# Altium project Sitara.PrjPCB (part 2 of 2)

## Sheet RF.SchDoc: sitara
size A4; CompanyName: SPAN; Engineer: Goverdhan; Organization: University of Utah; Address1: 50 S Central Campus Dr; Address2: MEB Rm 3129; Address3: Salt Lake City, Utah 84115; Address4: USA; Revision: 1; SheetNumber: 4; SheetTotal: 4
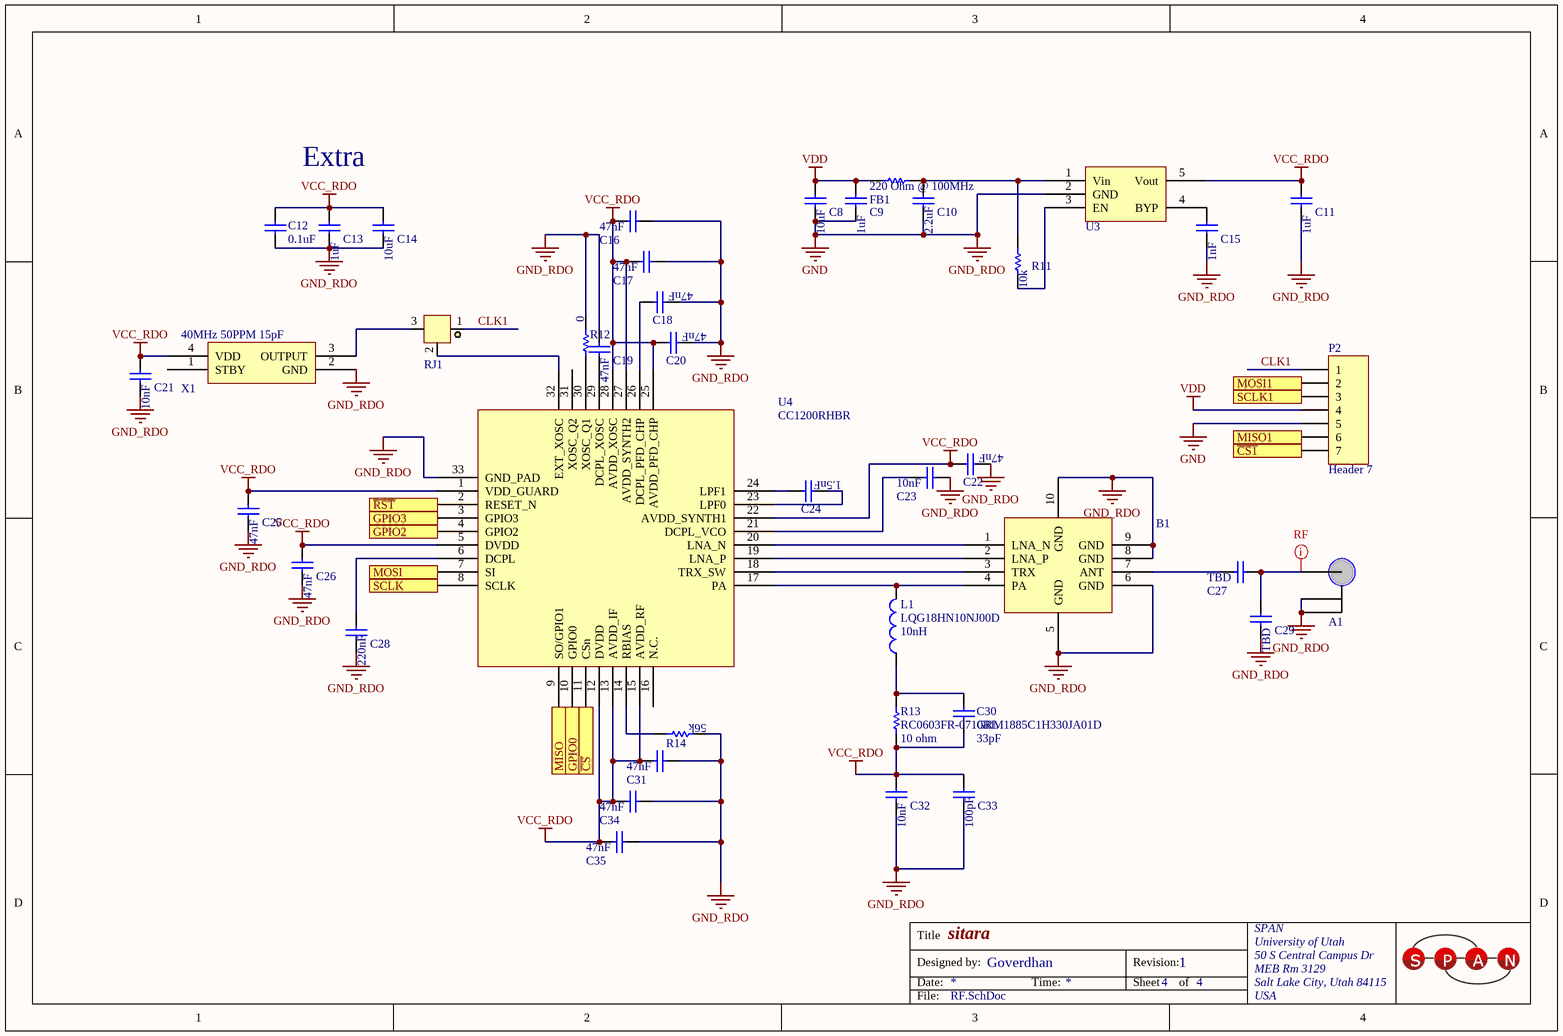
[diagram p3: RF.SchDoc]

### Parts
A1  U.FL-R-SMT(01)  [U.FL-R-SMT-1]  (value not drawn)
B1  0900PC15J0013  [0900PC15J0013]  (value not drawn)
C8  GRM188R60J106ME47D  [CAPC1608X08N (0603)]  (value not drawn)
C9  GRM188R61A105KA61D  [CAPC1608X08N (0603)]  (value not drawn)
C10  GRM188F51A225ZE01D  [CAPC1608X08N (0603)]  (value not drawn)
C11  GRM188R61A105KA61D  [CAPC1608X08N (0603)]  (value not drawn)
C12  0.1uF  [0603_Cap]
C13  GRM188R61A105KA61D  [CAPC1608X08N (0603)]  (value not drawn)
C14  GRM188R60J106ME47D  [CAPC1608X08N (0603)]  (value not drawn)
C15  GRM1885C1H102JA01D  [CAPC1608X08N (0603)]  (value not drawn)
C16  GCM188R71H473KA55D  [CAPC1608X08N (0603)]  (value not drawn)
C17  GCM188R71H473KA55D  [CAPC1608X08N (0603)]  (value not drawn)
C18  GCM188R71H473KA55D  [CAPC1608X08N (0603)]  (value not drawn)
C19  GCM188R71H473KA55D  [CAPC1608X08N (0603)]  (value not drawn)
C20  GCM188R71H473KA55D  [CAPC1608X08N (0603)]  (value not drawn)
C21  GRM188R71H103MA01D  [CAPC1608X08N (0603)]  (value not drawn)
C22  GCM188R71H473KA55D  [CAPC1608X08N (0603)]  (value not drawn)
C23  GRM188R71H103MA01D  [CAPC1608X08N (0603)]  (value not drawn)
C24  GRM1885C1H152JA01D  [CAPC1608X08N (0603)]  (value not drawn)
C25  GCM188R71H473KA55D  [CAPC1608X08N (0603)]  (value not drawn)
C26  GCM188R71H473KA55D  [CAPC1608X08N (0603)]  (value not drawn)
C27  C_TBD  [CAPC1608X08N (0603)]  (value not drawn)
C28  GRM188R71E224KA88D  [CAPC1608X08N (0603)]  (value not drawn)
C29  C_TBD  [CAPC1608X08N (0603)]  (value not drawn)
C30  GRM1885C1H330JA01D  value 33pF  [CAPC1608X08N (0603)]
C31  GCM188R71H473KA55D  [CAPC1608X08N (0603)]  (value not drawn)
C32  GRM188R71H103MA01D  [CAPC1608X08N (0603)]  (value not drawn)
C33  GQM1885C1H101JB01D  [CAPC1608X08N (0603)]  (value not drawn)
C34  GCM188R71H473KA55D  [CAPC1608X08N (0603)]  (value not drawn)
C35  GCM188R71H473KA55D  [CAPC1608X08N (0603)]  (value not drawn)
FB1  BLM18BD221SN1D  [RESC1608X06N (0603)]  (value not drawn)
L1  LQG18HN10NJ00D  value 10nH  [INDC1608X08N]
P2  Header 7  [HDR1X7]
R11  RC0603FR-0710KL  [RESC1608X06N (0603)]  (value not drawn)
R12  MCR03ERTJ000  [RESC1608X06N (0603)]  (value not drawn)
R13  RC0603FR-0710RL  value 10 ohm  [RESC1608X06N (0603)]
R14  MCR03ERTJ563  [RESC1608X06N (0603)]  (value not drawn)
RJ1  R_J  [RJ]  (value not drawn)
U3  FAN2500S30X  [SOT95P280X145-5N]  (value not drawn)
U4  CC1200RHBR  [S-PVQFN-N32]
X1  ASE-40.000MHZ-L-C-T  [3.2x2.5x1.2mmXTAL]  (value not drawn)

### Ports
GPIO0, GPIO2, GPIO3, MISO, MISO1, MOSI, MOSI1, SCLK, SCLK1, ~{CS1}, ~{CS}, ~{RST}

### Nets
GND: A1.2 A1.3 B1.5(GND) B1.6(GND) B1.8(GND) B1.9(GND) B1.10(GND) C8.1 C9.1 C10.1 C11.1 C12.1 C13.1 C14.1 C15.1 C16.2 C17.2 C18.1 C19.2 C20.1 C21.1 C22.1 C23.2 C25.1 C26.1 C28.1 C29.1 C31.2 C32.1 C33.1 C34.2 C35.2 P2.5 R12.1 R14.1 U3.2(GND) U4.33(GND_PAD) X1.2(GND)  [also labelled GND_RDO]
VCC_RDO: C11.2 C12.2 C13.2 C14.2 C16.1 C17.1 C20.2 C21.2 C22.2 C25.2 C26.2 C30.1 C31.1 C32.2 C33.2 C34.1 C35.1 R13.1 U3.5(Vout) U4.1(VDD_GUARD) U4.5(DVDD) U4.12(DVDD) U4.13(AVDD_IF) U4.15(AVDD_RF) U4.22(AVDD_SYNTH1) U4.25(AVDD_PFD_CHP) U4.27(AVDD_SYNTH2) U4.28(AVDD_XOSC) X1.4(VDD)
VDD: C8.2 C9.2 FB1.1 P2.4
CHFILT_1: U4.4(GPIO2) ; port GPIO2
CLK1: P2.1 RJ1.1
GPIO0_1: U4.10(GPIO0) ; port GPIO0
MAGN_1: U4.3(GPIO3) ; port GPIO3
RST_N: U4.2(RESET_N) ; port ~{RST}
SPI0_CS: P2.7 ; port ~{CS1}
SPI0_MISO: P2.6 ; port MISO1
SPI0_MOSI: P2.2 ; port MOSI1
SPI0_SCLK: P2.3 ; port SCLK1
SPI1_CS: U4.11(CSn) ; port ~{CS}
SPI1_MISO: U4.9(SO/GPIO1) ; port MISO
SPI1_MOSI: U4.7(SI) ; port MOSI
SPI1_SCLK: U4.8(SCLK) ; port SCLK
NetA1_1: A1.1 C27.2 C29.2
NetB1_1: B1.1(LNA_N) U4.20(LNA_N)
NetB1_2: B1.2(LNA_P) U4.19(LNA_P)
NetB1_3: B1.3(TRX) U4.18(TRX_SW)
NetB1_4: B1.4(PA) L1.2 U4.17(PA)
NetB1_7: B1.7(ANT) C27.1
NetC10_2: C10.2 FB1.2 R11.2 U3.1(Vin)
NetC15_2: C15.2 U3.4(BYP)
NetC18_2: C18.2 U4.26(DCPL_PFD_CHP)
NetC19_1: C19.1 U4.29(DCPL_XOSC)
NetC23_1: C23.1 U4.21(DCPL_VCO)
NetC24_1: C24.1 U4.23(LPF0)
NetC24_2: C24.2 U4.24(LPF1)
NetC28_2: C28.2 U4.6(DCPL)
NetC30_2: C30.2 L1.1 R13.2
NetR11_1: R11.1 U3.3(EN)
NetR12_2: R12.2 U4.30(XOSC_Q1)
NetR14_2: R14.2 U4.14(RBIAS)
NetRJ1_2: RJ1.2 U4.32(EXT_XOSC)
NetRJ1_3: RJ1.3 X1.3(OUTPUT)

Not connected (* = marked no-connect by the designer): U4 16(N.C.) 31(XOSC_Q2); X1 1(STBY)

### Layout directives
net class RF: NetA1_1

### Notes on the sheet
- Extra
- Title
- Designed by:
- Date:
- Time:
- Revision:
- Sheet
- of
- File:
- (in symbol ASE-40.000MHZ-L-C-T) 40MHz 50PPM 15pF
- (in symbol C_TBD) TBD
- (in symbol GCM188R71H473KA55D) 47nF
- (in symbol GRM188F51A225ZE01D) 2.2uF
- (in symbol GRM188R60J106ME47D) 10uF
- (in symbol GRM188R61A105KA61D) 1uF
- (in symbol GRM188R71E224KA88D) 220nF
- (in symbol GRM188R71H103MA01D) 10nF
- (in symbol GRM1885C1H102JA01D) 1nF
- (in symbol GRM1885C1H152JA01D) 1.5nF
- (in symbol MCR03ERTJ000) 0

### Library data of the parts
A1 = U.FL-R-SMT(01): CONN UMC JACK STR 50 OHM SMD; Manufacturer: Hirose Electric Co Ltd; Connector Style: Ultra Miniature Coaxial; Connector Type: Jack, Male Pin; Contact Termination: Solder; Impedance: 50 Ohm; Frequency - Max: 6GHz; Body Material: Phosphor Bronze; Body Finish: Silver; Center Contact Plating: Gold; Dielectric Material: Liquid Crystal Polymer (LCP); Supplier 1: Digi-Key; Manufacturer Part Number: U.FL-R-SMT(01); RoHS: RoHS Compliant; Category: Connectors, Interconnects; Stock 1: 22286; Pricing 1: 1=1.28, 10=1.122, 25=1.056, 50=1.012, 100=0.968, 250=0.88, 500=0.792, 1000=0.704, 2500=0.638 (USD); Packaging: Bulk; Shield Termination: Solder; Mounting Type: Surface Mount; Cable Group: -; Fastening Type: Snap-On; Features: -; Housing Color: Silver; Ingress Protection: -; Center Contact Material: Phosphor Bronze; Voltage Rating: -; Operating Temperature: -40°C ~ 90°C; ComponentLink1URL: http://www.hirose.co.jp/cataloge_hp/e32119372.pdf; ComponentLink1Description: http://www.hirose.co.jp/cataloge_hp/e32119372.pdf
B1 = 0900PC15J0013: TI CC1120 1121 BALUN FILTER IPC; Manufacturer: Johanson Technology Inc.; Frequency Range: 868MHz ~ 928MHz; Impedance - Unbalanced/Balanced: 50 / 50 Ohm; Phase Difference: 180° ±15; Insertion Loss (Max): 2.0dB; Return Loss (Min): 9.5dB; Supplier 1: Digi-Key; Manufacturer Part Number: 0900PC15J0013; RoHS: RoHS Compliant; Category: RF/IF and RFID; Stock 1: 6483; Pricing 1: 1=1.6, 10=1.563, 25=1.0464, 50=0.9314, 100=0.8533, 250=0.7656, 500=0.74966, 1000=0.5423 (USD); Packaging: Cut Tape (CT); Part Status: Active; Package / Case: 0805 (2012 Metric), 10 PC Pad; Mounting Type: Surface Mount; ComponentLink1URL: http://www.johansontechnology.com/datasheets/highly-integrated-passive-components/0900PC15J0013.pdf; ComponentLink1Description: http://www.johansontechnology.com/datasheets/highly-integrated-passive-components/0900PC15J0013.pdf; Supplier Part Number 1: 712-1586-1-ND
C8 C14 = GRM188R60J106ME47D: CAP CER 10UF 6.3V 20% X5R 0603; Manufacturer: Murata Electronics North America; Capacitance: 10µF; Supplier 1: Digi-Key; Manufacturer Part Number: GRM188R60J106ME47D; RoHS: RoHS Compliant; Category: Capacitors; Stock 1: 2128324; Pricing 1: 1=0.24, 10=0.2, 50=0.1126, 100=0.1, 250=0.075, 500=0.06626, 1000=0.05875 (USD); Packaging: Digi-Reel®; Voltage - Rated: 6.3V; Tolerance: ±20%; Temperature Coefficient: X5R; Mounting Type: Surface Mount, MLCC; Operating Temperature: -55°C ~ 85°C; Applications: General Purpose; Ratings: -; Package / Case: 0603 (1608 Metric); Size / Dimension: 0.063" L x 0.031" W (1.60mm x 0.80mm); Height - Seated (Max): -; Thickness (Max): 0.035" (0.90mm); Lead Spacing: -; Features: -; Lead Style: -; ComponentLink1URL: http://search.murata.co.jp/Ceramy/image/img/A01X/G101/ENG/GRM188R60J106ME47-01.pdf; ComponentLink1Description: http://search.murata.co.jp/Ceramy/image/img/A01X/G101/ENG/GRM188R60J106ME47-01.pdf; Supplier 2: Digi-Key
C9 C11 C13 = GRM188R61A105KA61D: CAP CER 1UF 10V 10% X5R 0603; Manufacturer: Murata Electronics North America; Capacitance: 1.0µF; Supplier 1: Digi-Key; Manufacturer Part Number: GRM188R61A105KA61D; RoHS: RoHS Compliant; Category: Capacitors; Stock 1: 244919; Pricing 1: 1=0.1, 10=0.041, 50=0.0224, 100=0.019, 250=0.01552, 500=0.01328, 1000=0.01035 (USD); Packaging: Cut Tape (CT); Voltage - Rated: 10V; Tolerance: ±10%; Temperature Coefficient: X5R; Mounting Type: Surface Mount, MLCC; Operating Temperature: -55°C ~ 85°C; Applications: General Purpose; Ratings: -; Package / Case: 0603 (1608 Metric); Size / Dimension: 0.063" L x 0.031" W (1.60mm x 0.80mm); Height - Seated (Max): -; Thickness (Max): 0.035" (0.90mm); Lead Spacing: -; Features: -; Lead Style: -; ComponentLink1URL: http://search.murata.co.jp/Ceramy/image/img/A01X/G101/ENG/GRM188R61A105KA61-01.pdf; ComponentLink1Description: http://search.murata.co.jp/Ceramy/image/img/A01X/G101/ENG/GRM188R61A105KA61-01.pdf
C10 = GRM188F51A225ZE01D: CAP CER 2.2UF 10V Y5V 0603; Manufacturer: Murata Electronics North America; Capacitance: 2.2µF; Tolerance: -20%, +80%; Temperature Coefficient: Y5V (F); Supplier 1: Digi-Key; Manufacturer Part Number: GRM188F51A225ZE01D; RoHS: RoHS Compliant; Category: Capacitors; Stock 1: 8000; Pricing 1: 4000=0.02043, 8000=0.019, 12000=0.01805, 28000=0.0171 (USD); Packaging: Tape & Reel (TR); Voltage - Rated: 10V; Mounting Type: Surface Mount, MLCC; Operating Temperature: -30°C ~ 85°C; Applications: General Purpose; Ratings: -; Package / Case: 0603 (1608 Metric); Size / Dimension: 0.063" L x 0.031" W (1.60mm x 0.80mm); Height - Seated (Max): -; Thickness (Max): 0.035" (0.90mm); Lead Spacing: -; Features: -; Lead Style: -; ComponentLink1URL: http://search.murata.co.jp/Ceramy/image/img/A01X/G101/ENG/GRM188F51A225ZE01-01.pdf; ComponentLink1Description: http://search.murata.co.jp/Ceramy/image/img/A01X/G101/ENG/GRM188F51A225ZE01-01.pdf
C12 = 0603YC104KAT4A: CAP CER 0.1UF 16V X7R 0603; Manufacturer: AVX Corporation; Capacitance: 0.1µF; Tolerance: ±10%; Supplier 1: Digi-Key; Manufacturer Part Number: 0603YC104KAT4A; RoHS: RoHS Compliant; Category: Capacitors; Stock 1: 15000; Pricing 1: 15000=0.00344, 30000=0.00327, 75000=0.00292, 105000=0.00237 (USD); Packaging: Tape & Reel (TR); Part Status: Active; Voltage - Rated: 16V; Temperature Coefficient: X7R; Operating Temperature: -55°C ~ 125°C; Features: -; Ratings: -; Applications: General Purpose; Failure Rate: -; Mounting Type: Surface Mount, MLCC; Package / Case: 0603 (1608 Metric); Size / Dimension: 0.063" L x 0.032" W (1.60mm x 0.81mm); Height - Seated (Max): -; Thickness (Max): 0.035" (0.90mm); Lead Spacing: -; Lead Style: -; ComponentLink1URL: http://datasheets.avx.com/X7RDielectric.pdf; ComponentLink1Description: http://datasheets.avx.com/X7RDielectric.pdf; Supplier Part Number 1: 478-10054-2-ND
C15 = GRM1885C1H102JA01D: CAP CER 1000PF 50V 5% NP0 0603; Manufacturer: Murata Electronics North America; Temperature Coefficient: C0G, NP0; Supplier 1: Digi-Key; Manufacturer Part Number: GRM1885C1H102JA01D; RoHS: RoHS Compliant; Category: Capacitors; Stock 1: 140000; Pricing 1: 4000=0.00863, 8000=0.00788, 12000=0.0075, 28000=0.00713, 100000=0.00516 (USD); Packaging: Tape & Reel (TR); Capacitance: 1000pF; Voltage - Rated: 50V; Tolerance: ±5%; Mounting Type: Surface Mount, MLCC; Operating Temperature: -55°C ~ 125°C; Applications: General Purpose; Ratings: -; Package / Case: 0603 (1608 Metric); Size / Dimension: 0.063" L x 0.031" W (1.60mm x 0.80mm); Height - Seated (Max): -; Thickness (Max): 0.035" (0.90mm); Lead Spacing: -; Features: -; Lead Style: -; ComponentLink1URL: http://www.murata.com/products/catalog/pdf/c02e.pdf; ComponentLink1Description: http://www.murata.com/products/catalog/pdf/c02e.pdf
C16-C20 C22 C25 C26 C31 C34 C35 = GCM188R71H473KA55D: CAP CER 0.047UF 50V 10% X7R 0603; Manufacturer: Murata Electronics North America; Capacitance: 0.047µF; Supplier 1: Digi-Key; Manufacturer Part Number: GCM188R71H473KA55D; RoHS: RoHS Compliant; Category: Capacitors; Stock 1: 2444374; Pricing 1: 1=0.13, 10=0.09, 50=0.0518, 100=0.0428, 250=0.036, 500=0.03016, 1000=0.02475 (USD); Packaging: Cut Tape (CT); Voltage - Rated: 50V; Tolerance: ±10%; Temperature Coefficient: X7R; Mounting Type: Surface Mount, MLCC; Operating Temperature: -55°C ~ 125°C; Applications: Automotive; Ratings: AEC-Q200; Package / Case: 0603 (1608 Metric); Size / Dimension: 0.063" L x 0.031" W (1.60mm x 0.80mm); Height - Seated (Max): -; Thickness (Max): 0.035" (0.90mm); Lead Spacing: -; Features: -; Lead Style: -; ComponentLink1URL: http://www.murata.com/products/catalog/pdf/c03e.pdf; ComponentLink1Description: http://www.murata.com/products/catalog/pdf/c03e.pdf
C21 C23 C32 = GRM188R71H103MA01D: CAP CER 10000PF 50V 20% X7R 0603; Manufacturer: Murata Electronics North America; Supplier 1: Digi-Key; Manufacturer Part Number: GRM188R71H103MA01D; RoHS: RoHS Compliant; Category: Capacitors; Stock 1: 24000; Pricing 1: 4000=0.00345, 8000=0.00315, 12000=0.003, 28000=0.00285, 100000=0.00206 (USD); Packaging: Tape & Reel (TR); Capacitance: 10000pF; Voltage - Rated: 50V; Tolerance: ±20%; Temperature Coefficient: X7R; Mounting Type: Surface Mount, MLCC; Operating Temperature: -55°C ~ 125°C; Applications: General Purpose; Ratings: -; Package / Case: 0603 (1608 Metric); Size / Dimension: 0.063" L x 0.031" W (1.60mm x 0.80mm); Height - Seated (Max): -; Thickness (Max): 0.035" (0.90mm); Lead Spacing: -; Features: -; Lead Style: -; ComponentLink1URL: http://search.murata.co.jp/Ceramy/image/img/A01X/G101/ENG/GRM188R71H103MA01-01.pdf; ComponentLink1Description: http://search.murata.co.jp/Ceramy/image/img/A01X/G101/ENG/GRM188R71H103MA01-01.pdf
C24 = GRM1885C1H152JA01D: CAP CER 1500PF 50V 5% NP0 0603; Manufacturer: Murata Electronics North America; Temperature Coefficient: C0G, NP0; Supplier 1: Digi-Key; Manufacturer Part Number: GRM1885C1H152JA01D; RoHS: RoHS Compliant; Category: Capacitors; Stock 1: 64000; Pricing 1: 4000=0.01699, 8000=0.0158, 12000=0.01501, 28000=0.01422, 100000=0.01077 (USD); Packaging: Tape & Reel (TR); Capacitance: 1500pF; Voltage - Rated: 50V; Tolerance: ±5%; Mounting Type: Surface Mount, MLCC; Operating Temperature: -55°C ~ 125°C; Applications: General Purpose; Ratings: -; Package / Case: 0603 (1608 Metric); Size / Dimension: 0.063" L x 0.031" W (1.60mm x 0.80mm); Height - Seated (Max): -; Thickness (Max): 0.035" (0.90mm); Lead Spacing: -; Features: -; Lead Style: -; ComponentLink1URL: http://www.murata.com/products/catalog/pdf/c02e.pdf; ComponentLink1Description: http://www.murata.com/products/catalog/pdf/c02e.pdf
C27 C29 = C_TBD: Value: DNP; Mounting Type: Surface Mount, MLCC; Applications: General Purpose; Package / Case: 0603 (1608 Metric)
C28 = GRM188R71E224KA88D: CAP CER 0.22UF 25V 10% X7R 0603; Manufacturer: Murata Electronics North America; Capacitance: 0.22µF; Supplier 1: Digi-Key; Manufacturer Part Number: GRM188R71E224KA88D; RoHS: RoHS Compliant; Category: Capacitors; Stock 1: 27242; Pricing 1: 1=0.14, 10=0.098, 50=0.0564, 100=0.0466, 250=0.0392, 500=0.03284, 1000=0.02695 (USD); Packaging: Cut Tape (CT); Voltage - Rated: 25V; Tolerance: ±10%; Temperature Coefficient: X7R; Mounting Type: Surface Mount, MLCC; Operating Temperature: -55°C ~ 125°C; Applications: General Purpose; Ratings: -; Package / Case: 0603 (1608 Metric); Size / Dimension: 0.063" L x 0.031" W (1.60mm x 0.80mm); Height - Seated (Max): -; Thickness (Max): 0.035" (0.90mm); Lead Spacing: -; Features: -; Lead Style: -; ComponentLink1URL: http://www.murata.com/products/catalog/pdf/c02e.pdf; ComponentLink1Description: http://www.murata.com/products/catalog/pdf/c02e.pdf; Supplier 2: Digi-Key
C30 = GRM1885C1H330JA01D: CAP CER 33PF 50V NP0 0603; Manufacturer: Murata Electronics North America; Tolerance: ±5%; Temperature Coefficient: C0G, NP0; Supplier 1: Digi-Key; Manufacturer Part Number: GRM1885C1H330JA01D; RoHS: RoHS Compliant; Category: Capacitors; Stock 1: 394990; Pricing 1: 1=0.1, 10=0.029, 50=0.0156, 100=0.0132, 250=0.0108, 500=0.00924, 1000=0.0072 (USD); Packaging: Cut Tape (CT); Capacitance: 33pF; Voltage - Rated: 50V; Mounting Type: Surface Mount, MLCC; Operating Temperature: -55°C ~ 125°C; Applications: General Purpose; Ratings: -; Package / Case: 0603 (1608 Metric); Size / Dimension: 0.063" L x 0.031" W (1.60mm x 0.80mm); Height - Seated (Max): -; Thickness (Max): 0.035" (0.90mm); Lead Spacing: -; Features: -; Lead Style: -; ComponentLink1URL: http://www.murata.com/~/media/webrenewal/support/library/catalog/products/capacitor/mlcc/c02e.pdf; ComponentLink1Description: http://www.murata.com/~/media/webrenewal/support/library/catalog/products/capacitor/mlcc/c02e.pdf; Supplier Part Number 1: 490-1415-1-ND
C33 = GQM1885C1H101JB01D: CAP CER 100PF 50V 5% NP0 0603; Manufacturer: Murata Electronics North America; Temperature Coefficient: C0G, NP0; Supplier 1: Digi-Key; Manufacturer Part Number: GQM1885C1H101JB01D; RoHS: RoHS Compliant; Category: Capacitors; Stock 1: 5529; Pricing 1: 1=0.78, 10=0.75, 50=0.448, 100=0.364, 250=0.3024, 500=0.2744, 1000=0.252 (USD); Packaging: Cut Tape (CT); Capacitance: 100pF; Voltage - Rated: 50V; Tolerance: ±5%; Mounting Type: Surface Mount, MLCC; Operating Temperature: -55°C ~ 125°C; Applications: RF, Microwave, High Frequency; Ratings: -; Package / Case: 0603 (1608 Metric); Size / Dimension: 0.063" L x 0.031" W (1.60mm x 0.80mm); Height - Seated (Max): -; Thickness (Max): 0.035" (0.90mm); Lead Spacing: -; Features: High Q, Low Loss; Lead Style: -; ComponentLink1URL: http://www.murata.com/products/catalog/pdf/c02e.pdf; ComponentLink1Description: http://www.murata.com/products/catalog/pdf/c02e.pdf
FB1 = BLM18BD221SN1D: FERRITE CHIP 220 OHM 200MA 0603; Manufacturer: Murata Electronics North America; Impedance @ Frequency: 220 Ohm @ 100MHz; DC Resistance (DCR): 450 mOhm Max; Filter Type: Differential Mode - Single; Supplier 1: Digi-Key; Manufacturer Part Number: BLM18BD221SN1D; RoHS: RoHS Compliant; Category: Filters; Stock 1: 35645; Pricing 1: 1=0.1, 10=0.087, 50=0.0712, 100=0.0523, 250=0.038, 500=0.03484, 1000=0.0301 (USD); Packaging: Cut Tape (CT); Current Rating: 200mA; Package / Case: 0603 (1608 Metric); Mounting Type: Surface Mount; Height (Max): 0.037" (0.95mm); Size / Dimension: 0.063" L x 0.031" W (1.60mm x 0.80mm); ComponentLink1URL: http://search.murata.co.jp/Ceramy/image/img/PDF/ENG/L0110S0100BLM18B.pdf; ComponentLink1Description: http://search.murata.co.jp/Ceramy/image/img/PDF/ENG/L0110S0100BLM18B.pdf
L1 = LQG18HN10NJ00D: FIXED IND 10NH 400MA 300 MOHM; Manufacturer: Murata Electronics North America; Type: Multilayer; Material - Core: Air; Tolerance: ±5%; Shielding: Unshielded; DC Resistance (DCR): 300 mOhm Max; Q @ Freq: 12 @ 100MHz; Frequency - Self Resonant: 3.5GHz; Frequency - Test: 100MHz; Supplier 1: Digi-Key; Manufacturer Part Number: LQG18HN10NJ00D; RoHS: RoHS Compliant; Category: Inductors, Coils, Chokes; Stock 1: 14010; Pricing 1: 1=0.21, 10=0.187, 25=0.168, 50=0.1454, 100=0.1306, 250=0.12124, 500=0.1119, 750=0.10631, 1000=0.09698 (USD); Packaging: Cut Tape (CT); Inductance: 10nH; Current Rating: 400mA; Current - Saturation: -; Operating Temperature: -40°C ~ 85°C; Mounting Type: Surface Mount; Package / Case: 0603 (1608 Metric); Size / Dimension: 0.063" L x 0.031" W (1.60mm x 0.80mm); Height - Seated (Max): 0.037" (0.95mm); ComponentLink1URL: http://search.murata.co.jp/Ceramy/image/img/PDF/ENG/L0075S0083LQG18H.pdf; ComponentLink1Description: http://search.murata.co.jp/Ceramy/image/img/PDF/ENG/L0075S0083LQG18H.pdf; Ratings: -; Supplier Part Number 1: 490-6574-1-ND
P2 = Header 7: Header, 7-Pin; LatestRevisionDate: 17-Jul-2002; LatestRevisionNote: Re-released for DXP Platform.; Publisher: Altium Limited
R11 = RC0603FR-0710KL: RES 10.0K OHM 1/10W 1% 0603 SMD; Manufacturer: Yageo; Resistance (Ohms): 10k; Power (Watts): 0.1W, 1/10W; Temperature Coefficient: ±100ppm/°C; Supplier 1: Digi-Key; Manufacturer Part Number: RC0603FR-0710KL; RoHS: RoHS Compliant; Category: Resistors; Stock 1: 11245000; Pricing 1: 5000=0.00171, 10000=0.00149, 25000=0.00131, 50000=0.0012, 125000=0.00117 (USD); Packaging: Tape & Reel (TR); Tolerance: ±1%; Composition: Thick Film; Features: -; Package / Case: 0603 (1608 Metric); Supplier Device Package: 0603; Size / Dimension: 0.063" L x 0.031" W (1.60mm x 0.80mm); Height: 0.022" (0.55mm); Number of Terminations: 2; ComponentLink1URL: http://www.yageo.com/documents/recent/PYu-RC0603_51_RoHS_L_4.pdf; ComponentLink1Description: http://www.yageo.com/documents/recent/PYu-RC0603_51_RoHS_L_4.pdf
R12 = MCR03ERTJ000: RES 0.0 OHM 1/10W JUMP 0603 SMD; Manufacturer: Rohm Semiconductor; Resistance (Ohms): 0.0; Tolerance: Jumper; Power (Watts): 0.1W, 1/10W; Supplier 1: Digi-Key; Manufacturer Part Number: MCR03ERTJ000; RoHS: RoHS Compliant; Category: Resistors; Stock 1: 127296; Pricing 1: 1=0.1, 25=0.0064, 100=0.0035, 250=0.00268, 500=0.00214, 1000=0.00157 (USD); Packaging: Cut Tape (CT); Composition: Thick Film; Features: -; Temperature Coefficient: -; Package / Case: 0603 (1608 Metric); Supplier Device Package: 0603 (1608 Metric); Size / Dimension: 0.063" L x 0.031" W (1.60mm x 0.80mm); Height: 0.022" (0.55mm); Number of Terminations: 2; ComponentLink1URL: http://rohmfs.rohm.com/en/products/databook/datasheet/passive/resistor/chip_resistor/mcr_g.pdf; ComponentLink1Description: http://rohmfs.rohm.com/en/products/databook/datasheet/passive/resistor/chip_resistor/mcr_g.pdf
R13 = RC0603FR-0710RL: RES SMD 10 OHM 1% 1/10W 0603; Manufacturer: Yageo; Resistance (Ohms): 10; Power (Watts): 0.1W, 1/10W; Temperature Coefficient: ±200ppm/°C; Supplier 1: Digi-Key; Manufacturer Part Number: RC0603FR-0710RL; RoHS: RoHS Compliant; Category: Resistors; Stock 1: 1047153; Pricing 1: 1=0.1, 10=0.014, 25=0.01, 100=0.0057, 250=0.00436, 500=0.00348, 1000=0.00257, 2500=0.00223 (USD); Packaging: Cut Tape (CT); Tolerance: ±1%; Composition: Thick Film; Features: Moisture Resistant; Package / Case: 0603 (1608 Metric); Supplier Device Package: 0603; Size / Dimension: 0.063" L x 0.031" W (1.60mm x 0.80mm); Height: 0.022" (0.55mm); Number of Terminations: 2; ComponentLink1URL: http://www.yageo.com/NewPortal/yageodocoutput?fileName=/pdf/R-Chip/PYu-RC_Group_51_RoHS_L_3.pdf; ComponentLink1Description: http://www.yageo.com/NewPortal/yageodocoutput?fileName=/pdf/R-Chip/PYu-RC_Group_51_RoHS_L_3.pdf; Operating Temperature: -55°C ~ 155°C; Supplier Part Number 1: 311-10.0HRCT-ND
R14 = MCR03ERTJ563: RES 56K OHM 1/10W 5% 0603 SMD; Manufacturer: Rohm Semiconductor; Power (Watts): 0.1W, 1/10W; Temperature Coefficient: ±200ppm/°C; Supplier 1: Digi-Key; Manufacturer Part Number: MCR03ERTJ563; RoHS: RoHS Compliant; Category: Resistors; Stock 1: 5000; Pricing 1: 5000=0.00184, 10000=0.0016, 25000=0.00144, 50000=0.00128, 125000=0.00106 (USD); Packaging: Tape & Reel (TR); Resistance (Ohms): 56k; Tolerance: ±5%; Composition: Thick Film; Features: -; Package / Case: 0603 (1608 Metric); Supplier Device Package: 0603 (1608 Metric); Size / Dimension: 0.063" L x 0.031" W (1.60mm x 0.80mm); Height: 0.022" (0.55mm); Number of Terminations: 2; ComponentLink1URL: http://rohmfs.rohm.com/en/products/databook/datasheet/passive/resistor/chip_resistor/mcr_g.pdf; ComponentLink1Description: http://rohmfs.rohm.com/en/products/databook/datasheet/passive/resistor/chip_resistor/mcr_g.pdf
RJ1 = R_J: Resistor Jumper; Value: DNP; Mounting Type: Surface Mount, MLCC; Applications: General Purpose; Package / Case: 0603 (1608 Metric)
U3 = FAN2500S30X: IC REG LDO 3V 0.1A SOT23-5; Manufacturer: Fairchild Semiconductor; Regulator Topology: Positive Fixed; Current - Output: 100mA; Voltage - Dropout (Typical): 0.1V @ 100mA; Number of Regulators: 1; Voltage - Input: Up to 6.5V; Supplier 1: Digi-Key; Manufacturer Part Number: FAN2500S30X; RoHS: RoHS Compliant; Category: Integrated Circuits (ICs); Stock 1: 6000; Pricing 1: 3000=0.25462, 6000=0.23706, 15000=0.22828, 30000=0.2195, 75000=0.21599, 150000=0.21072 (USD); Packaging: Tape & Reel (TR); Voltage - Output: 3V; Current - Limit (Min): -; Operating Temperature: -40°C ~ 125°C; Mounting Type: Surface Mount; Package / Case: SC-74A, SOT-753; Supplier Device Package: SOT-23-5; ComponentLink1URL: http://www.fairchildsemi.com/ds/FA/FAN2500.pdf; ComponentLink1Description: http://www.fairchildsemi.com/ds/FA/FAN2500.pdf
U4 = CC1200RHBR: IC RF TXRX SNGL-CHIP LP 32-QFN; Manufacturer: Texas Instruments; Frequency: 164MHz ~ 190MHz, 410MHz ~ 475MHz, 820MHz ~ 950MHz; Data Rate (Max): 1.25Mbps; Modulation or Protocol: FSK, GFSK, MSK, OOK; Power - Output: 16dBm; Sensitivity: -125dBm; Voltage - Supply: 2 V ~ 3.6 V; Current - Receiving: 19mA; Current - Transmitting: 54mA; Data Interface: PCB, Surface Mount; Supplier 1: Digi-Key; Manufacturer Part Number: CC1200RHBR; RoHS: RoHS Compliant; Category: RF/IF and RFID; Stock 1: 0; Pricing 1: 3000=2.926 (USD); Packaging: Tape & Reel (TR); Applications: General Purpose; Memory Size: -; Antenna Connector: PCB, Surface Mount; Operating Temperature: -40°C ~ 85°C; Package / Case: 32-VFQFN Exposed Pad; ComponentLink1URL: http://www.ti.com/lit/ds/symlink/cc1200.pdf; ComponentLink1Description: http://www.ti.com/lit/ds/symlink/cc1200.pdf
X1 = ASE-40.000MHZ-L-C-T: OSC XO 40.0000MHZ LVCMOS SMD; Manufacturer: Abracon LLC; Frequency: 40MHz; Function: Enable/Disable; Output: CMOS; Voltage - Supply: 3.3V; Frequency Stability: ±50ppm; Current - Supply (Max): 13mA; Current - Supply (Disable) (Max): 10µA; Supplier 1: Digi-Key; Manufacturer Part Number: ASE-40.000MHZ-L-C-T; RoHS: RoHS Compliant; Category: Crystals, Oscillators, Resonators; Stock 1: 2000; Pricing 1: 1=1.26, 10=1.209, 50=1.1804, 100=1.0118, 500=0.98368 (USD); Packaging: Cut Tape (CT); Part Status: Active; Type: XO (Standard); Operating Temperature: -40°C ~ 85°C; Ratings: -; Mounting Type: Surface Mount; Package / Case: 4-SMD, No Lead (DFN, LCC); Size / Dimension: 0.126" L x 0.098" W (3.20mm x 2.50mm); Height - Seated (Max): 0.047" (1.20mm); ComponentLink1URL: http://www.abracon.com/Oscillators/ASEseries.pdf; ComponentLink1Description: http://www.abracon.com/Oscillators/ASEseries.pdf; Supplier Part Number 1: 535-13489-1-ND

## Nets that join several sheets
GND: Power_System (21 pins), BLE_USB_nRF52840 (38 pins), RF (38 pins)
VBUS: Power_System (C3.2 CONN1.1 U2.13), BLE_USB_nRF52840 (C56.2 U6.AD2)
VDD: Power_System (C5.2 U1.5), BLE_USB_nRF52840 (21 pins), RF (C8.2 C9.2 FB1.1 P2.4)
CHFILT_1: BLE_USB_nRF52840 (U6.B15), RF (U4.4)
D1_N: Power_System (CONN1.2), BLE_USB_nRF52840 (U6.AD4)
D1_P: Power_System (CONN1.3), BLE_USB_nRF52840 (U6.AD6)
GPIO0_1: BLE_USB_nRF52840 (U6.A20), RF (U4.10)
MAGN_1: BLE_USB_nRF52840 (U6.A16), RF (U4.3)
RST_N: BLE_USB_nRF52840 (U6.A8), RF (U4.2)
SPI0_CS: BLE_USB_nRF52840 (U6.A10), RF (P2.7)
SPI0_MISO: BLE_USB_nRF52840 (U6.B11), RF (P2.6)
SPI0_MOSI: BLE_USB_nRF52840 (U6.J1), RF (P2.2)
SPI0_SCLK: BLE_USB_nRF52840 (U6.B13), RF (P2.3)
SPI1_CS: BLE_USB_nRF52840 (U6.AD8), RF (U4.11)
SPI1_MISO: BLE_USB_nRF52840 (U6.AD10), RF (U4.9)
SPI1_MOSI: BLE_USB_nRF52840 (U6.AD18), RF (U4.7)
SPI1_SCLK: BLE_USB_nRF52840 (U6.AD16), RF (U4.8)